# EAGLE design driver2REV1 (EAGLE 6.1)

## Sheet 1 of 2
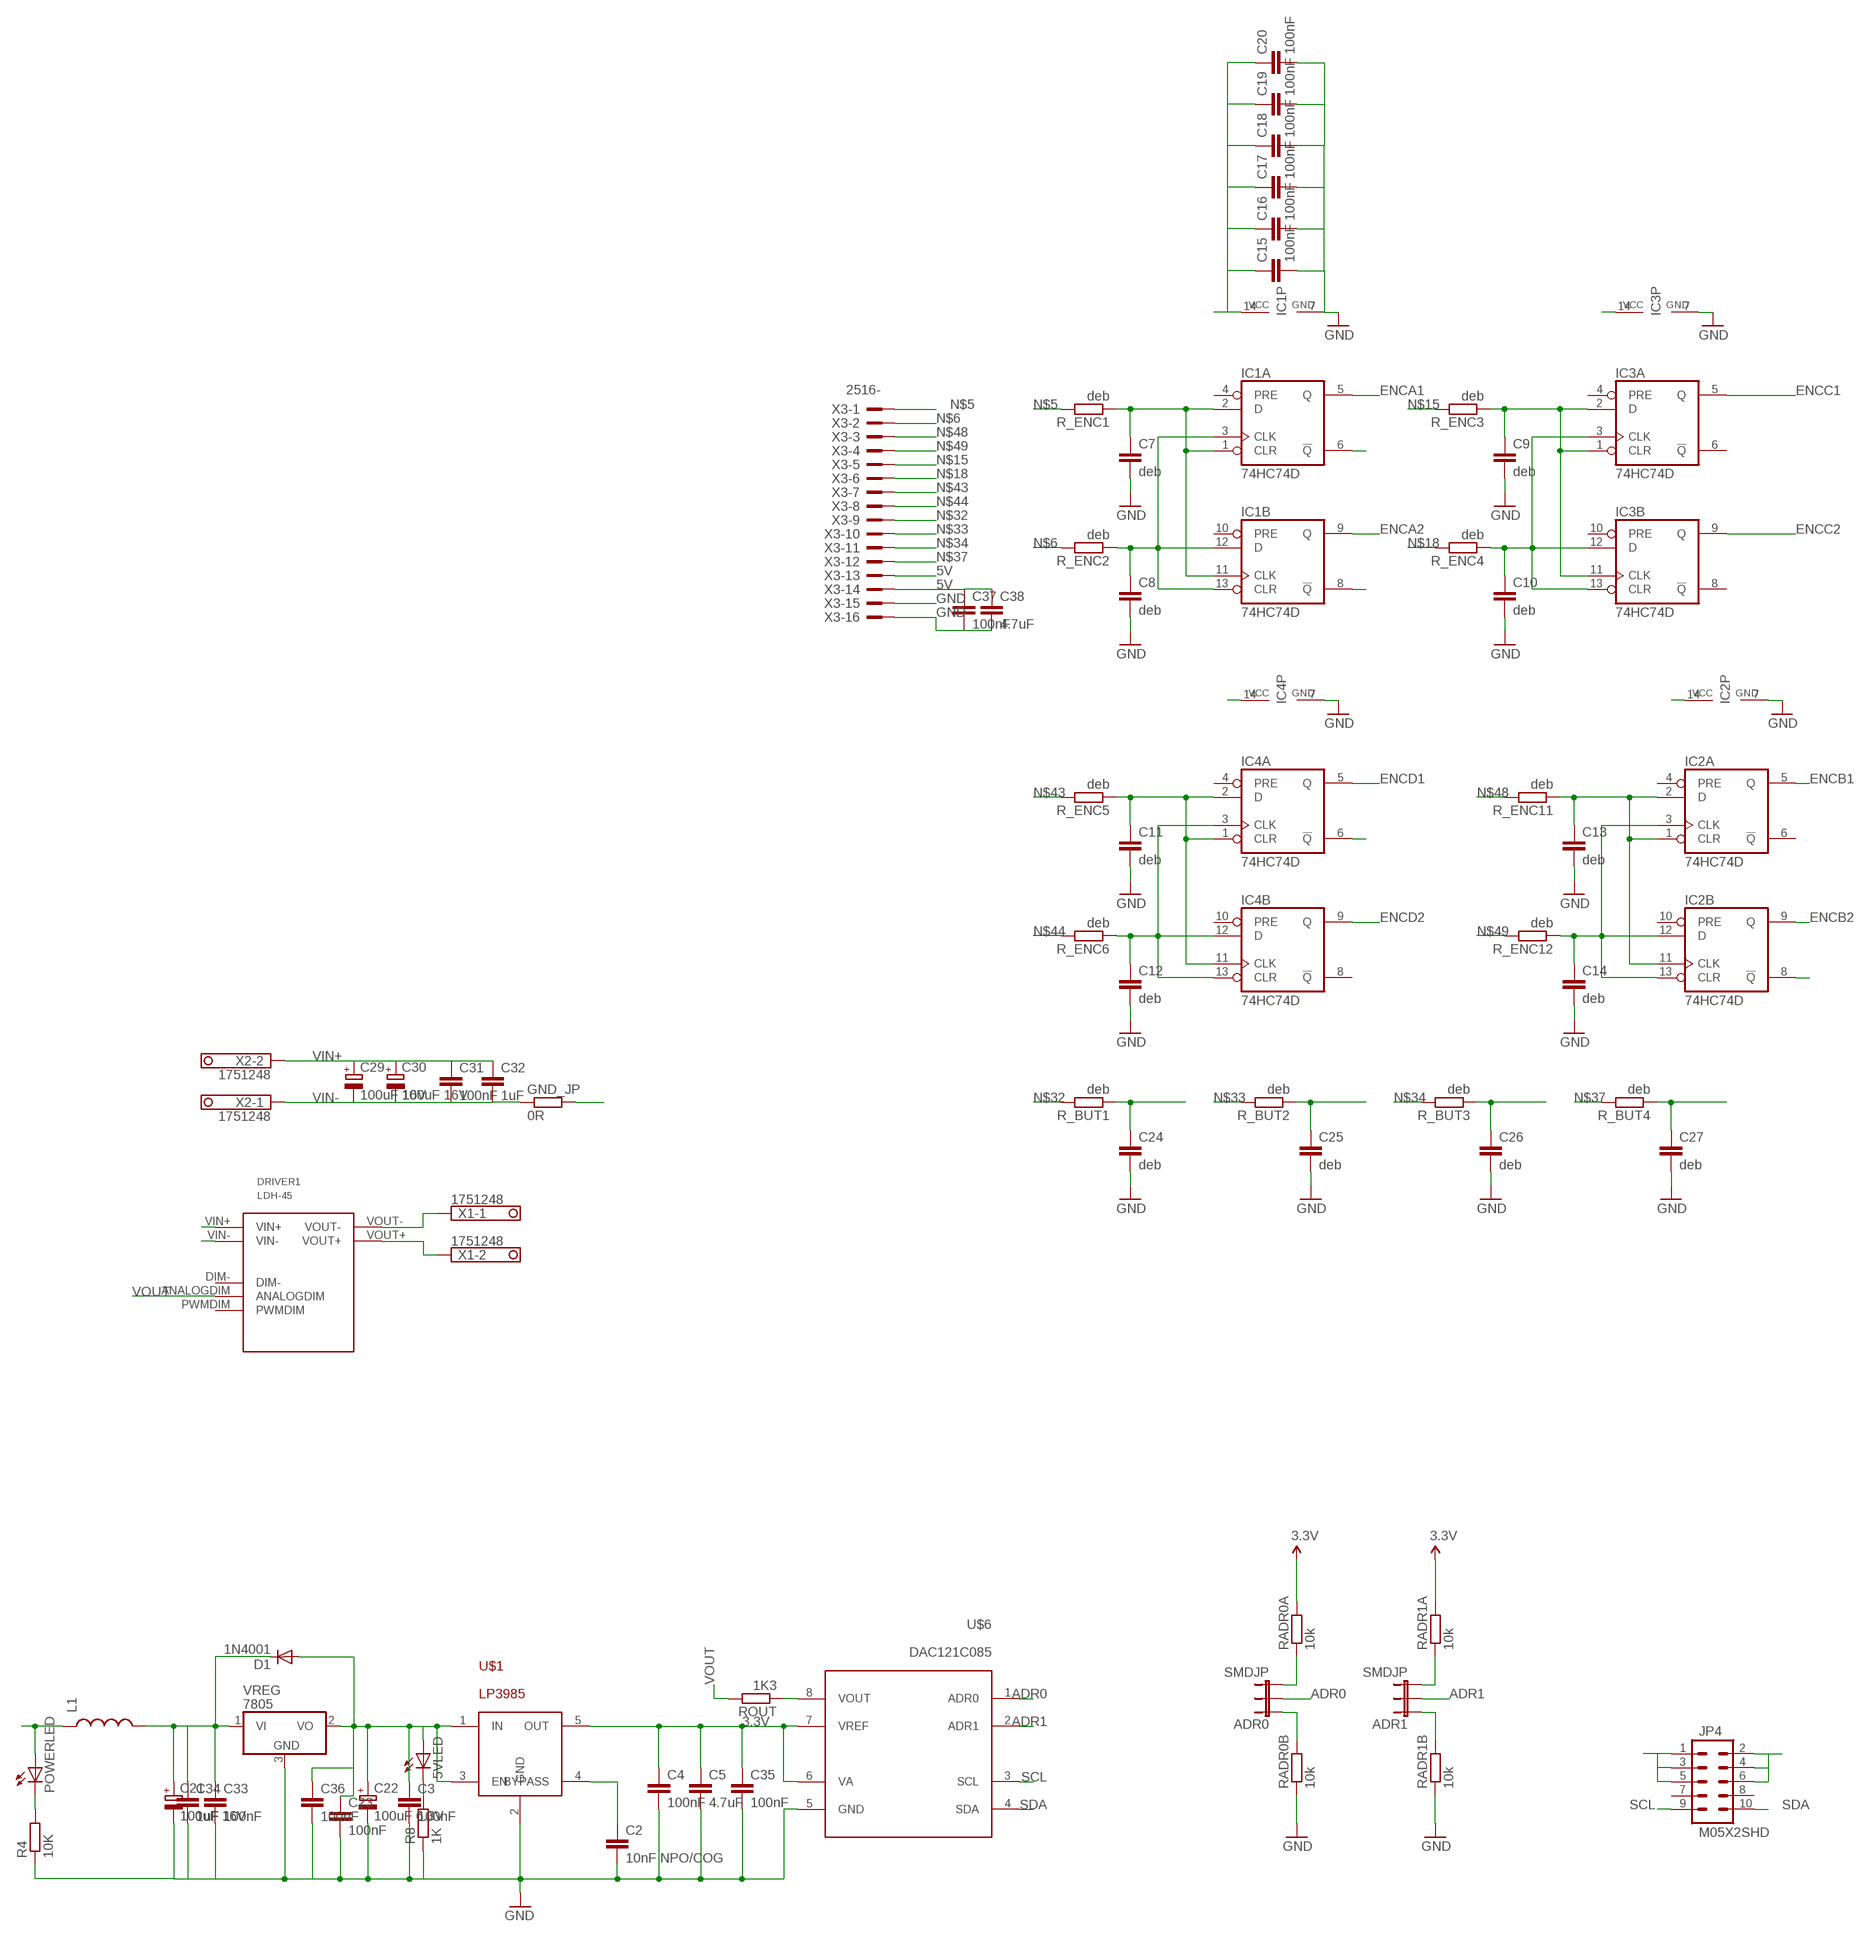
[diagram p0: schematic, sheet 1]

### Parts
5VLED  LEDCHIP-LED0805  [CHIP-LED0805]
ADR0  SMDJP  JUMPER-3-OLDSMD  [SJ_3]
ADR1  SMDJP  JUMPER-3-OLDSMD  [SJ_3]
C2  10nF NPO/COG  C-EUC0805  [C0805]
C3  100nF  C-EUC0805  [C0805]
C4  100nF  C-EUC0805  [C0805]
C5  4.7uF  C-EUC0805  [C0805]
C7  deb  C-EUC0805  [C0805]
C8  deb  C-EUC0805  [C0805]
C9  deb  C-EUC0805  [C0805]
C10  deb  C-EUC0805  [C0805]
C11  deb  C-EUC0805  [C0805]
C12  deb  C-EUC0805  [C0805]
C13  deb  C-EUC0805  [C0805]
C14  deb  C-EUC0805  [C0805]
C15  100nF  C-EUC0805  [C0805]
C16  100nF  C-EUC0805  [C0805]
C17  100nF  C-EUC0805  [C0805]
C18  100nF  C-EUC0805  [C0805]
C19  100nF  C-EUC0805  [C0805]
C20  100nF  C-EUC0805  [C0805]
C21  100uF 16V  CPOL-EUUD-6,3X8,8  [UD-6,3X5,8_NICHICON]
C22  100uF 6.3V  CPOL-EUUD-6,3X8,8  [UD-6,3X5,8_NICHICON]
C23  100nF  C-EUC0805  [C0805]
C24  deb  C-EUC0805  [C0805]
C25  deb  C-EUC0805  [C0805]
C26  deb  C-EUC0805  [C0805]
C27  deb  C-EUC0805  [C0805]
C29  100uF 16V  CPOL-EUUD-6,3X8,8  [UD-6,3X5,8_NICHICON]
C30  100uF 16V  CPOL-EUUD-6,3X8,8  [UD-6,3X5,8_NICHICON]
C31  100nF  C-EUC0805  [C0805]
C32  1uF  C-EUC0805  [C0805]
C33  100nF  C-EUC0805  [C0805]
C34  1uF  C-EUC0805  [C0805]
C35  100nF  C-EUC0805  [C0805]
C36  100nF  C-EUC0805  [C0805]
C37  100nF  C-EUC0805  [C0805]
C38  4.7uF  C-EUC0805  [C0805]
D1  1N4001  DIODESMB  [SMB-DIODE]
DRIVER1  LDH-45  [LDH-45]
GND_JP  0R  R-EU_R1210  [R1210]
IC1  74HC74D  [SO14]
IC2  74HC74D  [SO14]
IC3  74HC74D  [SO14]
IC4  74HC74D  [SO14]
JP4  M05X2SHD  [2X5-SHROUDED]
L1  INDUCTOR0805  [0805]
POWERLED  LEDCHIP-LED0805  [CHIP-LED0805]
R4  10K  R-EU_R0805  [R0805]
R8  1K  R-EU_R0805  [R0805]
R_BUT1  deb  R-EU_R0603  [R0603]
R_BUT2  deb  R-EU_R0603  [R0603]
R_BUT3  deb  R-EU_R0603  [R0603]
R_BUT4  deb  R-EU_R0603  [R0603]
R_ENC1  deb  R-EU_R0603  [R0603]
R_ENC2  deb  R-EU_R0603  [R0603]
R_ENC3  deb  R-EU_R0603  [R0603]
R_ENC4  deb  R-EU_R0603  [R0603]
R_ENC5  deb  R-EU_R0603  [R0603]
R_ENC6  deb  R-EU_R0603  [R0603]
R_ENC11  deb  R-EU_R0603  [R0603]
R_ENC12  deb  R-EU_R0603  [R0603]
RADR0A  10k  R-EU_R0603  [R0603]
RADR0B  10k  R-EU_R0603  [R0603]
RADR1A  10k  R-EU_R0603  [R0603]
RADR1B  10k  R-EU_R0603  [R0603]
ROUT  1K3  R-EU_R0603  [R0603]
U$1  LP3985  [SOT23-5]
U$6  DAC121C085  [VSSOP-8]
VREG  7805  7805DT  [TO252]
X1  1751248  [1751248]
X2  1751248  [1751248]
X3  2516-  [PAK100/2500-16]

### Nets
3.3V: C4.1 C5.1 C35.1 RADR0A.2 RADR1A.2 U$1.5(OUT) U$6.6(VA) U$6.7(VREF) ; also sheet 2
5V: 5VLED.A C3.1 C15.1 C16.1 C17.1 C18.1 C19.1 C20.1 C22.+ C23.1 C36.1 C37.1 C38.1 D1.A IC1.14(P:VCC) IC2.14(P:VCC) IC3.14(P:VCC) IC4.14(P:VCC) JP4.2 JP4.4 JP4.6 U$1.1(IN) U$1.3(EN) VREG.2(VO) X3.13 X3.14 ; also sheet 2
ADR0: ADR0.2 U$6.1(ADR0)
ADR1: ADR1.2 U$6.2(ADR1)
BUTA: C24.1 R_BUT1.1 ; also sheet 2
BUTB: C25.1 R_BUT2.1 ; also sheet 2
BUTC: C26.1 R_BUT3.1 ; also sheet 2
BUTD: C27.1 R_BUT4.1 ; also sheet 2
ENCA1: IC1.5(A:Q) ; also sheet 2
ENCA2: IC1.9(B:Q) ; also sheet 2
ENCB1: IC2.5(A:Q) ; also sheet 2
ENCB2: IC2.9(B:Q) ; also sheet 2
ENCC1: IC3.5(A:Q) ; also sheet 2
ENCC2: IC3.9(B:Q) ; also sheet 2
ENCD1: IC4.5(A:Q) ; also sheet 2
ENCD2: IC4.9(B:Q) ; also sheet 2
GND: C2.2 C3.2 C4.2 C5.2 C7.2 C8.2 C9.2 C10.2 C11.2 C12.2 C13.2 C14.2 C15.2 C16.2 C17.2 C18.2 C19.2 C20.2 C21.- C22.- C23.2 C24.2 C25.2 C26.2 C27.2 C33.2 C34.2 C35.2 C36.2 C37.2 C38.2 GND_JP.2 IC1.7(P:GND) IC2.7(P:GND) IC3.7(P:GND) IC4.7(P:GND) JP4.1 JP4.3 JP4.5 R4.1 R8.1 RADR0B.1 RADR1B.1 U$1.2(GND) U$6.5(GND) VREG.3(GND) X3.15 X3.16 ; also sheet 2
N$2: DRIVER1.VOUT+ X1.2
N$3: IC1.6(A:!Q)
N$4: IC1.8(B:!Q)
N$5: R_ENC1.2 X3.1
N$6: R_ENC2.2 X3.2
N$7: ADR0.3 RADR0A.1
N$9: ADR0.1 RADR0B.2
N$10: ADR1.3 RADR1A.1
N$11: ADR1.1 RADR1B.2
N$12: C2.1 U$1.4(BYPASS)
N$13: C7.1 IC1.1(A:CLR) IC1.2(A:D) IC1.11(B:CLK) R_ENC1.1
N$14: C8.1 IC1.3(A:CLK) IC1.12(B:D) IC1.13(B:CLR) R_ENC2.1
N$15: R_ENC3.2 X3.5
N$17: C21.+ C33.1 C34.1 D1.C L1.2 VREG.1(VI)
N$18: R_ENC4.2 X3.6
N$19: 5VLED.C R8.2
N$21: C9.1 IC3.1(A:CLR) IC3.2(A:D) IC3.11(B:CLK) R_ENC3.1
N$22: C10.1 IC3.3(A:CLK) IC3.12(B:D) IC3.13(B:CLR) R_ENC4.1
N$23: IC4.6(A:!Q)
N$27: C11.1 IC4.1(A:CLR) IC4.2(A:D) IC4.11(B:CLK) R_ENC5.1
N$28: C12.1 IC4.3(A:CLK) IC4.12(B:D) IC4.13(B:CLR) R_ENC6.1
N$29: POWERLED.C R4.2
N$32: R_BUT1.2 X3.9
N$33: R_BUT2.2 X3.10
N$34: R_BUT3.2 X3.11
N$37: R_BUT4.2 X3.12
N$42: IC2.8(B:!Q)
N$43: R_ENC5.2 X3.7
N$44: R_ENC6.2 X3.8
N$45: C13.1 IC2.1(A:CLR) IC2.2(A:D) IC2.11(B:CLK) R_ENC11.1
N$46: C14.1 IC2.3(A:CLK) IC2.12(B:D) IC2.13(B:CLR) R_ENC12.1
N$47: ROUT.1 U$6.8(VOUT)
N$48: R_ENC11.2 X3.3
N$49: R_ENC12.2 X3.4
SCL: JP4.9 U$6.3(SCL) ; also sheet 2
SDA: JP4.10 U$6.4(SDA) ; also sheet 2
VIN+: C29.+ C30.+ C31.1 C32.1 DRIVER1.VIN+ L1.1 POWERLED.A X2.2
VIN-: C29.- C30.- C31.2 C32.2 DRIVER1.VIN- GND_JP.1 X2.1
VOUT: DRIVER1.ANALOGDIM ROUT.2
VOUT-: DRIVER1.VOUT- X1.1
Unconnected: DRIVER1.DIM- DRIVER1.PWMDIM IC1.4(A:PRE) IC1.10(B:PRE) IC2.4(A:PRE) IC2.6(A:!Q) IC2.10(B:PRE) IC3.4(A:PRE) IC3.6(A:!Q) IC3.8(B:!Q) IC3.10(B:PRE) IC4.4(A:PRE) IC4.8(B:!Q) IC4.10(B:PRE) JP4.7 JP4.8

## Sheet 2 of 2
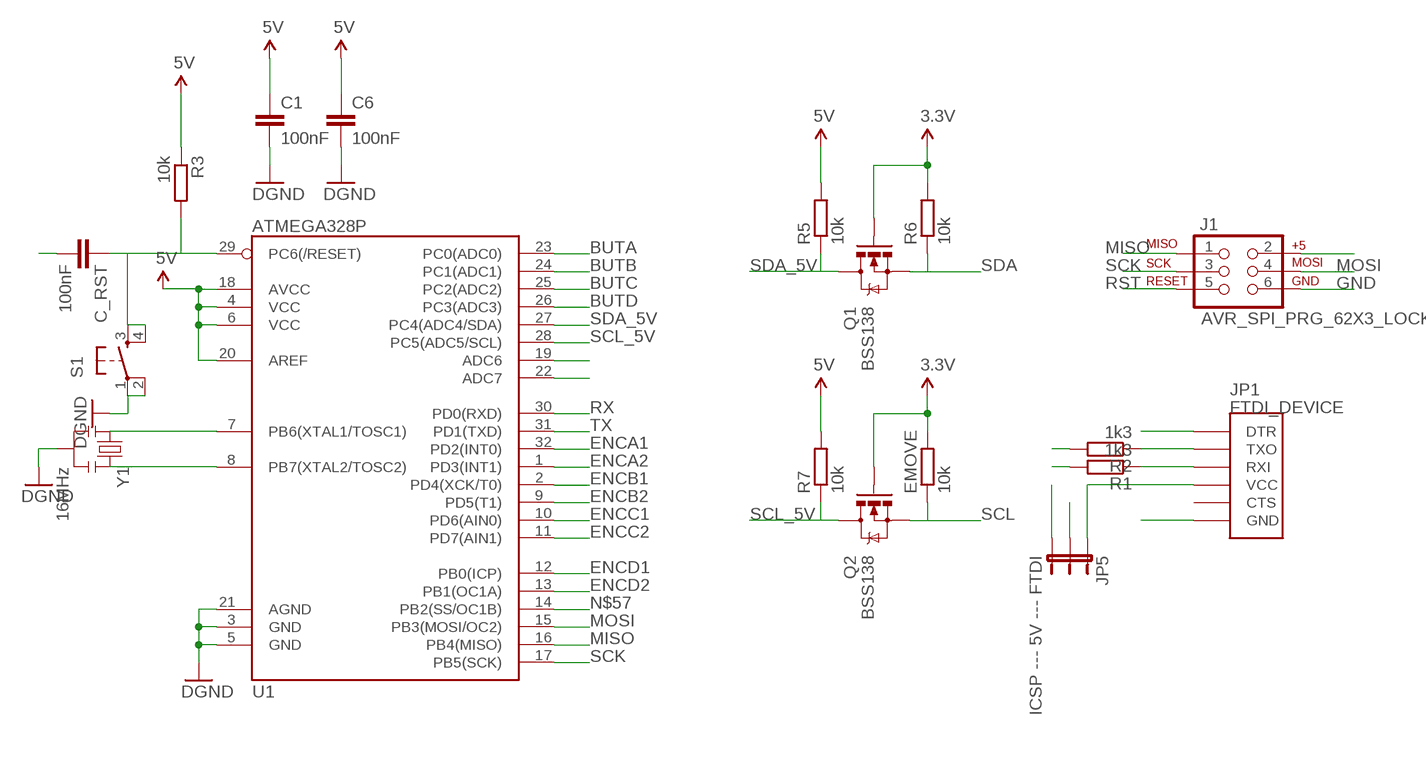
[diagram p1: schematic, sheet 2]

### Parts
C1  100nF  C-EUC0805  [C0805]
C6  100nF  C-EUC0805  [C0805]
C_RST  100nF  C-EUC0805  [C0805]
EMOVE  10k  R-EU_R0603  [R0603]
J1  AVR_SPI_PRG_62X3_LOCK  [2X3_LOCK]
JP1  FTDI_DEVICE  [FTDI_DEVICE_SIDE]
JP5  ICSP --- 5V --- FTDI  JUMPER-3SMD  [SJ_3]
Q1  BSS138  MOSFET-NCHANNELBSS138  [SOT23]
Q2  BSS138  MOSFET-NCHANNELBSS138  [SOT23]
R1  1k3  R-EU_R0603  [R0603]
R2  1k3  R-EU_R0603  [R0603]
R3  10k  R-EU_R0603  [R0603]
R5  10k  R-EU_R0603  [R0603]
R6  10k  R-EU_R0603  [R0603]
R7  10k  R-EU_R0603  [R0603]
S1  TAC_SWITCHSMD  [TACTILE_SWITCH_SMD]
U1  ATMEGA328P  ATMEGA328_SMT  [TQFP32-08]
Y1  16MHz  RESONATOR8MHZ  [RESONATOR-SMD]

### Nets
3.3V: EMOVE.2 Q1.1(G) Q2.1(G) R6.2 ; also sheet 1
5V: C1.1 C6.1 JP5.2 R3.1 R5.2 R7.2 U1.4(VCC) U1.6(VCC) U1.18(AVCC) U1.20(AREF) ; also sheet 1
BUTA: U1.23(PC0(ADC0)) ; also sheet 1
BUTB: U1.24(PC1(ADC1)) ; also sheet 1
BUTC: U1.25(PC2(ADC2)) ; also sheet 1
BUTD: U1.26(PC3(ADC3)) ; also sheet 1
ENCA1: U1.32(PD2(INT0)) ; also sheet 1
ENCA2: U1.1(PD3(INT1)) ; also sheet 1
ENCB1: U1.2(PD4(XCK/T0)) ; also sheet 1
ENCB2: U1.9(PD5(T1)) ; also sheet 1
ENCC1: U1.10(PD6(AIN0)) ; also sheet 1
ENCC2: U1.11(PD7(AIN1)) ; also sheet 1
ENCD1: U1.12(PB0(ICP)) ; also sheet 1
ENCD2: U1.13(PB1(OC1A)) ; also sheet 1
FTDI_RST: C_RST.2 JP1.P$1(DTR)
GND: C1.2 C6.2 J1.6 JP1.P$6(GND) S1.1 S1.2 U1.3(GND) U1.5(GND) U1.21(AGND) Y1.2 ; supply symbol labelled DGND ; also sheet 1
ISP_5V: J1.2 JP5.3
MISO: J1.1 U1.16(PB4(MISO))
MOSI: J1.4 U1.15(PB3(MOSI/OC2))
N$8: U1.7(PB6(XTAL1/TOSC1)) Y1.1
N$16: U1.8(PB7(XTAL2/TOSC2)) Y1.3
N$20: JP1.P$2(TXO) R2.1
N$24: JP1.P$3(RXI) R1.1
N$25: JP1.P$4(VCC) JP5.1
N$35: U1.19(ADC6)
N$36: U1.22(ADC7)
N$57: U1.14(PB2(SS/OC1B))
RST: C_RST.1 J1.5 R3.2 S1.3 S1.4 U1.29(PC6(/RESET))
RX: R1.2 U1.30(PD0(RXD))
SCK: J1.3 U1.17(PB5(SCK))
SCL: EMOVE.1 Q2.2(S) ; also sheet 1
SCL_5V: Q2.3(D) R7.1 U1.28(PC5(ADC5/SCL))
SDA: Q1.2(S) R6.1 ; also sheet 1
SDA_5V: Q1.3(D) R5.1 U1.27(PC4(ADC4/SDA))
TX: R2.2 U1.31(PD1(TXD))
Unconnected: JP1.P$5(CTS)

## Library data of the parts
5VLED POWERLED = adafruit:LED: LED OSRAM: - CHIPLED LG R971, LG N971, LY N971, LG Q971, LY Q971, LO R971, LY R971 LH N974, LH R974 LS Q976, LO Q976, LY Q976 LO Q996 - Hyper CHIPLED LW Q18S LB Q993, LB Q99A, LB R99A - SideLED LS A670, LO A670, LY A670, LG A670, LP A670 LB A673, LV A673, LT A673, LW A673 LH A674 LY A675 LS A676, LA A676, LO A676, LY A676, LW A676 LS A679, LY A679, LG A679 - Hyper Micro SIDELED® LS Y876, LA Y876, LO Y876, LY Y876 LT Y87S - SmartLED LW L88C, LW L88S LB L89C, LB L89S, LG L890 LS L89K, LO L89K, LY L89K LS L896, LA L896, LO L896, LY L896 - TOPLED LS T670, LO T670, LY T670, LG T670, LP T670 LSG T670, LSP T670, LSY T670, LOP T670, LYG T670 LG T671, LOG T671, LSG T671 LB T673, LV T673, LT T673, LW T673 LH T674 LS T676, LA T676, LO T676, LY T676, LB T676, LH T676, LSB T676, LW T676 LB T67C, LV T67C, LT T67C, LS T67K, LO T67K, LY T67K, LW E67C LS E67B, LA E67B, LO E67B, LY E67B, LB E67C, LV E67C, LT E67C LW T67C LS T679, LY T679, LG T679 LS T770, LO T770, LY T770, LG T770, LP T770 LB T773, LV T773, LT T773, LW T773 LH T774 LS E675, LA E675, LY E675, LS T675 LS T776, LA T776, LO T776, LY T776, LB T776 LHGB T686 LT T68C, LB T68C - Hyper Mini TOPLED® LB M676 - Mini TOPLED Santana® LG M470 LS M47K, LO M47K, LY M47K Source: http://www.osram.convergy.de/
ADR0 ADR1 = SparkFun-Passives:JUMPER-3-OLD
C1-C20 C23-C27 C31-C38 C_RST = wes:C-EU: CAPACITOR, European symbol
C21 C22 C29 C30 = rcl:CPOL-EU: POLARIZED CAPACITOR, European symbol
D1 = SparkFun-DiscreteSemi:DIODE: Diode These are standard reverse protection diodes and small signal diodes. SMA package can handle up to about 1A. SOD-323 can handle about 200mA. What the SOD-323 package when ordering, there are some mfgs out there that are 5-pin packages.
DRIVER1 = wes:LDH-45
EMOVE R1-R8 R_BUT1-R_BUT4 R_ENC1-R_ENC6 R_ENC11 R_ENC12 RADR0A RADR0B RADR1A RADR1B ROUT = wes:R-EU_: RESISTOR, European symbol
GND_JP = rcl:R-EU_: RESISTOR, European symbol
IC1-IC4 = 74xx-eu:74*74: Dual D type positive edge triggered FLIP FLOP, preset and clear
J1 = SparkFun-Connectors:AVR_SPI_PRG_6: AVR ISP 6 Pin This is the reduced ISP connector for AVR programming. Common on Arduino. This footprint will take up less PCB space and can be used with a 10-pin to 6-pin adapter such as SKU: BOB-08508
JP1 = SparkFun-Connectors:FTDI_DEVICE: Connector which mates to FTDI basic or FTDI cable.
JP4 = SparkFun-Connectors:M05X2: Header 5x2 Standard 10-pin dual row 0.1" header. Commonly used with AVR-ISP. Use with Spark Fun Electronics SKU: PRT-00778
JP5 = SparkFun-Passives:JUMPER-3
L1 = SparkFun-Passives:INDUCTOR: Inductors Basic Inductor/Choke - 0603 and 1206. Footprints are not proven and vary greatly between part numbers.
Q1 Q2 = SparkFun-DiscreteSemi:MOSFET-NCHANNEL: Common NMOSFET Parts MFG P/N Store ID Prod ID FDD8780 TRANS-09984 SI7820DN TRANS-11055 FDS6630A IC-08089 2N7002PW TRANS-11151 FQP30N06L COM-10213 TRANS-10060 BSS123LT1G TRANS-08345 BSS138 TRANS-00830 BS170 2N7000; PROD_ID: TRANS-00830
S1 = SparkFun-Electromechanical:TAC_SWITCH: Momentary Switch Button commonly used for reset or general input. Spark Fun Electronics SKU : COM-00097 SMT- SWCH-08247; PROD_ID: SWCH-08247
U1 = SparkFun-DigitalIC:ATMEGA328_SMT: 32-Pin Atmega328 part Commonly used on Arduino compatible boards Available in QFP and QFN packages TQFP is IC-09069 QFN is non-stock; PROD_ID: IC-09069
U$1 = wes:LP3985
U$6 = wes:DAC121C085
VREG = adafruit:78*: Positive VOLTAGE REGULATOR Added bigger pads to the TO-92 package
X1 X2 = con-phoenix-350:1751248: MKDS 1/ 2-3,5 Printklemme Nennstrom: 10 A Bemessungsspannung: 160 V Raster: 3,5 mm Polzahl: 2 Montageart: Löten Anschlussart: Schraubanschluss Anschlussrichtung vom Leiter zur Platine: 0° Source: http://eshop.phoenixcontact.com .. 1751248.pdf; OC_FARNELL: unknown; OC_NEWARK: unknown
X3 = con-3m:2516-: 3M (TM) Pak 100 4-Wall Header Source: 3M; OC_FARNELL: unknown; OC_NEWARK: unknown
Y1 = SparkFun-FreqCtrl:RESONATOR: Resonator Small SMD resonator. Used, eg, on the Arduino Pro/ Pro Mini boards. 8MHz- XTAL-08895 16MHz- XTAL-08900; PROD_ID: XTAL-08895; VALUE: 8MHZ

## Board
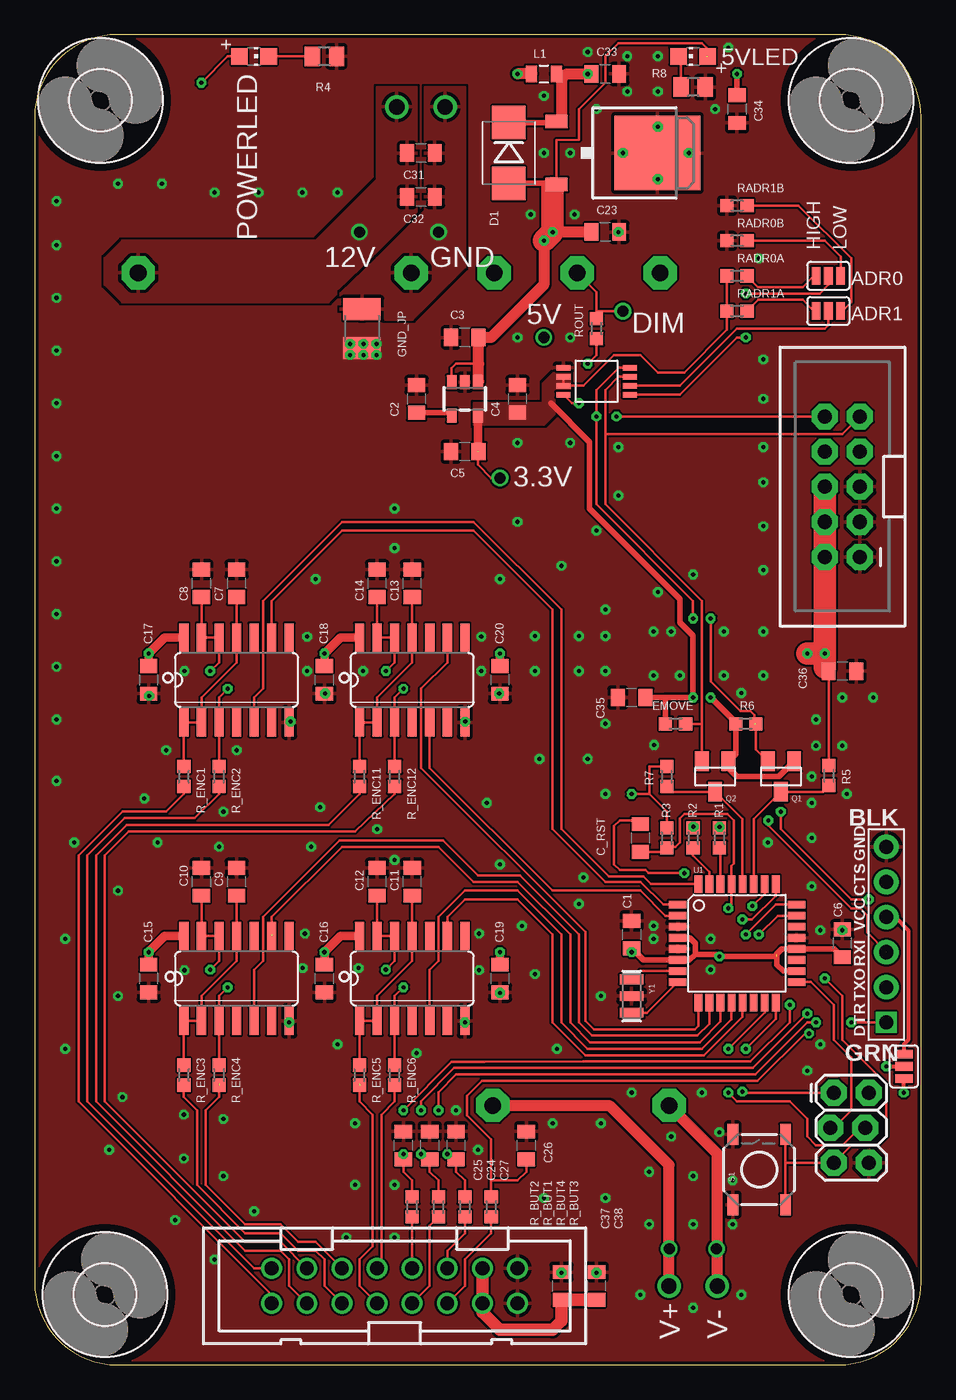
[diagram p2: board, top side]
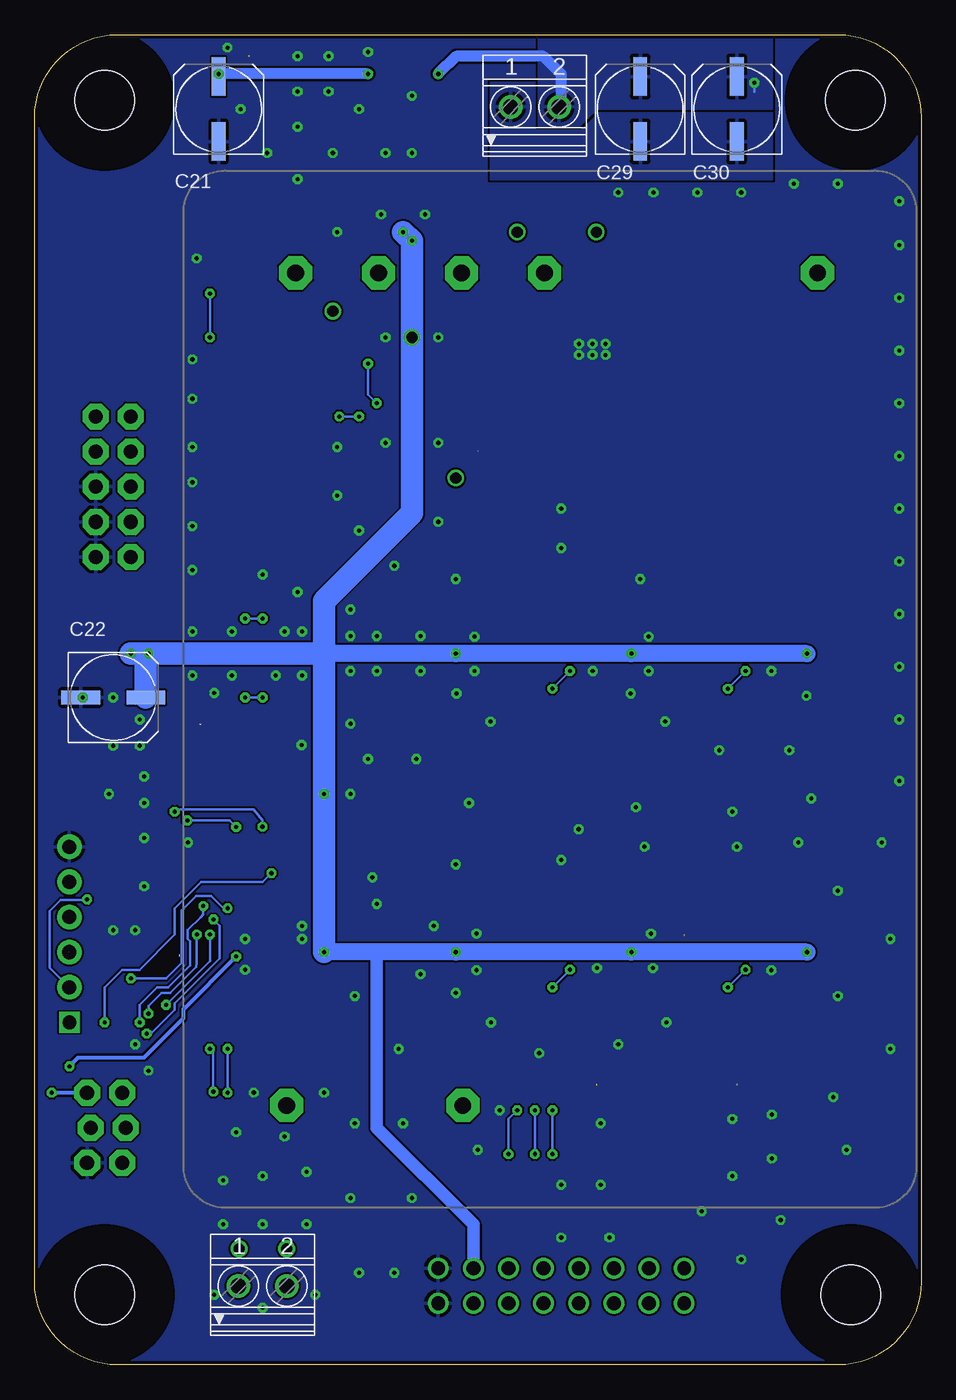
[diagram p3: board, bottom side, seen from below]

Size 64.11 x 96.19 mm. Coordinates in mm from the lower left corner, seen from the top.
Outline: 0,90.19 0,6 arc90 6,0 58.12,0 arc90 64.11,6 64.11,90.19 arc90 58.12,96.19 6,96.19 arc90 0,90.19
Copper layers (1*16): Top 0.035mm / dielectric 1.5mm / Bottom 0.035mm
Design rules: minimum track width 6mil, minimum drill 0.29mm, track to track 6mil, track to pad 7mil, pad to pad 7mil, via to via 7mil, smd to smd 7mil, copper to edge 10mil, drill to drill 8mil, minimum pad ring 10mil, minimum via ring 8mil, stop-mask expansion 0.4mm, vias tented up to drill 0.3mm, thermal gap 10mil

### Footprints (pad centres in the part's own frame; a part is rotated, then mirrored left to right if it is on the bottom)
CHIP-LED0805 = smd 1.2 x 1.2: A 0,-1.05; C 0,1.05
SJ_3 = smd 0.635 x 1.27: 1 -0.889,0; 2 0,0; 3 0.889,0
C0805 = smd 1 x 1.25: 1 -1,0; 2 1,0
UD-6,3X5,8_NICHICON = smd 2.8 x 1: + 2.35,0; - -2.35,0
SMB-DIODE = smd 2.4 x 2.4: A 2.2,0; C -2.2,0
LDH-45 = drill 1.2 pad 2.4 octagon: ANALOGDIM 14.1,-7.4; DIM- 20.1,-7.4; PWMDIM 8.1,-7.4; VIN+ 45.85,-7.4; VIN- 26.1,-7.4; VOUT+ 20.2,-67.6; VOUT- 7.45,-67.6
R0603 = smd 0.95 x 0.95: 1 -0.725,0; 2 0.725,0
R1210 = smd 1.6 x 2.7: 1 -1.4,0; 2 1.4,0
SO14 = smd 0.66 x 2.032: 1 -3.81,-3.073; 2 -2.54,-3.073; 3 -1.27,-3.073; 4 0,-3.073; 5 1.27,-3.073; 6 2.54,-3.073; 7 3.81,-3.073; 8 3.81,3.073; 9 2.54,3.073; 10 1.27,3.073; 11 0,3.073; 12 -1.27,3.073; 13 -2.54,3.073; 14 -3.81,3.073
2X3_LOCK = drill 1.016 pad 1.88 octagon: 1 0,0; 2 0,2.54; 3 2.54,-0.254; 4 2.54,2.286; 5 5.08,0; 6 5.08,2.54
FTDI_DEVICE_SIDE = drill 1 square: P$1 -6.35,0 | drill 1.016 pad 1.778: P$2 -3.81,0; P$3 -1.27,0; P$4 1.27,0; P$5 3.81,0; P$6 6.35,0
2X5-SHROUDED = drill 1.016 pad 1.88 octagon: 1 -1.27,5.08; 2 1.27,5.08; 3 -1.27,2.54; 4 1.27,2.54; 5 -1.27,0; 6 1.27,0; 7 -1.27,-2.54; 8 1.27,-2.54; 9 -1.27,-5.08; 10 1.27,-5.08
0805 = smd 0.8 x 1.2: 1 -0.9,0; 2 0.9,0
SOT23 = smd 1 x 1.4: 1 -0.95,-1.1; 2 0.95,-1.1; 3 0,1.1
R0805 = smd 1.1 x 1.4: 1 -0.875,0; 2 0.875,0
TACTILE_SWITCH_SMD = smd 1.524 x 0.762: 1 -2.54,1.905; 2 2.54,1.905; 3 -2.54,-1.905; 4 2.54,-1.905
TQFP32-08 = smd 1.27 x 0.559: 1 -4.293,2.8; 2 -4.293,2; 3 -4.293,1.2; 4 -4.293,0.4; 5 -4.293,-0.4; 6 -4.293,-1.2; 7 -4.293,-2; 8 -4.293,-2.8; 17 4.293,-2.8; 18 4.293,-2; 19 4.293,-1.2; 20 4.293,-0.4; 21 4.293,0.4; 22 4.293,1.2; 23 4.293,2; 24 4.293,2.8 | smd 0.559 x 1.27: 9 -2.8,-4.293; 10 -2,-4.293; 11 -1.2,-4.293; 12 -0.4,-4.293; 13 0.4,-4.293; 14 1.2,-4.293; 15 2,-4.293; 16 2.8,-4.293; 25 2.8,4.293; 26 2,4.293; 27 1.2,4.293; 28 0.4,4.293; 29 -0.4,4.293; 30 -1.2,4.293; 31 -2,4.293; 32 -2.8,4.293
SOT23-5 = smd 0.7 x 1: 1 0.95,1.2; 2 0,1.2; 3 -0.95,1.2; 4 -0.95,-1.2; 5 0.95,-1.2
4,3 = hole 4.3: 0,0
VSSOP-8 = smd 0.406 x 1.016: 1 -0.975,-2.4; 2 -0.325,-2.4; 3 0.325,-2.4; 4 0.975,-2.4; 5 0.975,2.4; 6 0.325,2.4; 7 -0.325,2.4; 8 -0.975,2.4
TO252 = smd 1 x 1.6: 1 -2.28,-4.8; 2 2.28,-4.8 | smd 5.4 x 6.2: 3 0,2.5
1751248 = drill 1.1 pad 1.7: 1 -1.75,-0.1; 2 1.75,-0.1
PAK100/2500-16 = drill 1 pad 1.422: 1 -8.89,-1.27; 2 -8.89,1.27; 3 -6.35,-1.27; 4 -6.35,1.27; 5 -3.81,-1.27; 6 -3.81,1.27; 7 -1.27,-1.27; 8 -1.27,1.27; 9 1.27,-1.27; 10 1.27,1.27; 11 3.81,-1.27; 12 3.81,1.27; 13 6.35,-1.27; 14 6.35,1.27; 15 8.89,-1.27; 16 8.89,1.27
RESONATOR-SMD = smd 0.7 x 1.7: 1 -1.2,0; 2 0,0; 3 1.2,0

### Placement (x,y rotation side)
5VLED  47.62,94.61 90 top
ADR0  57.4,78.74 180 top
ADR1  57.4,76.2 180 top
C1  43.18,31.11 90 top
C2  27.62,69.85 90 top
C3  31.11,74.3 180 top
C4  34.92,69.85 90 top
C5  31.11,66.04 180 top
C6  58.42,30.48 90 top
C7  14.61,56.52 90 top
C8  12.06,56.52 90 top
C9  14.61,34.92 90 top
C10  12.06,34.92 90 top
C11  27.3,34.92 90 top
C12  24.77,34.92 90 top
C13  27.3,56.52 90 top
C14  24.77,56.52 90 top
C15  8.26,27.95 270 top
C16  20.95,27.94 270 top
C17  8.26,49.53 270 top
C18  20.95,49.53 270 top
C19  33.66,27.94 270 top
C20  33.66,49.53 270 top
C21  50.8,90.81 90 bottom
C22  58.42,48.26 0 bottom
C23  41.27,81.92 0 top
C24  28.57,15.88 90 top
C25  26.67,15.88 90 top
C26  35.56,15.88 90 top
C27  30.48,15.88 90 top
C29  20.32,90.81 90 bottom
C30  13.34,90.81 90 bottom
C31  27.94,87.63 0 top
C32  27.94,84.45 0 top
C33  41.27,93.34 0 top
C34  50.8,90.81 270 top
C35  43.18,48.26 180 top
C36  58.42,50.16 0 top
C37  38.1,5.71 90 top
C38  40.64,5.71 90 top
C_RST  43.81,38.1 90 top
D1  34.29,87.63 270 top
DRIVER1  53.34,86.36 0 bottom
EMOVE  46.35,46.35 180 top
GND_JP  23.68,74.93 270 top
IC1  14.61,49.53 0 top
IC2  27.3,49.53 0 top
IC3  14.61,27.94 0 top
IC4  27.3,27.94 0 top
J1  57.78,19.68 270 top
JP1  61.59,31.11 90 top
JP4  58.42,63.5 180 top
JP5  62.87,21.59 270 top
L1  36.83,93.34 0 top
POWERLED  15.88,94.61 270 top
Q1  53.98,42.55 180 top
Q2  49.22,42.55 180 top
R1  49.53,38.1 270 top
R2  47.62,38.1 270 top
R3  45.72,38.1 270 top
R4  20.95,94.61 180 top
R5  57.44,42.62 90 top
R6  51.44,46.35 180 top
R7  45.72,42.55 90 top
R8  47.62,92.39 180 top
R_BUT1  29.21,11.43 270 top
R_BUT2  27.3,11.43 270 top
R_BUT3  33.02,11.43 270 top
R_BUT4  31.11,11.43 270 top
R_ENC1  10.79,42.55 270 top
R_ENC2  13.34,42.55 270 top
R_ENC3  10.79,20.95 270 top
R_ENC4  13.34,20.95 270 top
R_ENC5  23.5,20.95 270 top
R_ENC6  26.04,20.95 270 top
R_ENC11  23.5,42.55 270 top
R_ENC12  26.04,42.55 270 top
RADR0A  50.8,78.74 180 top
RADR0B  50.8,81.28 0 top
RADR1A  50.8,76.2 180 top
RADR1B  50.8,83.82 0 top
ROUT  40.64,74.93 90 top
S1  52.4,14.12 90 top
U1  50.8,30.48 0 top
U$1  31.11,69.85 0 top
U$2  [4,3]  4.76,91.44 0 top
U$3  [4,3]  59.05,91.44 0 top
U$4  [4,3]  5.08,5.08 0 top
U$5  [4,3]  59.05,5.08 0 top
U$6  40.64,71.12 90 top
VREG  42.55,87.63 270 top
X1  47.62,5.8 0 bottom
X2  27.94,91.06 0 bottom
X3  26.04,5.71 0 top
Y1  43.18,26.67 270 top

### Tracks (layer width: path | path; a pad name or v marks a point on that pad's centre or on a via)
3.3V  (via drill 0.3 pad 0.5, 0.8 pad 0.5)  (1 unrouted)
  Top 0.178: U$1.5 32.06,68.89 | 32.06,66.09 C5.1 | Q2.1 50.17,43.18 | R6.2 50.71,46.45 | RADR0A.2 RADR1A.2 50.08,74.84 46.99,71.75 45.09,71.75 43.81,73.03 41.91,73.03 39.68,70.8 U$6.7 U$6.6 | 32.07,66.04 32.07,65.09 33.02,64.14 v33.66,64.14
  Top 0.406: 50.17,43.18 50.8,42.55 53.83,42.55 Q1.1 | R6.2 50.71,44.19 Q2.1 | 50.71,46.45 v48.9,48.26 | 45.63,48.26 45.72,48.26 v47.62,48.26 47.62,52.72 46.67,53.67 46.67,55.38 40.14,61.92 40.14,66.74 37.34,69.54 | 45.63,48.26 EMOVE.2 | C35.1 45.63,48.26
  Top 0.61: U$1.5 32.06,66.09
  Bottom 0.178: v48.9,48.26 v47.62,48.26
  pour Top (no thermals): 38.74,71.72 37.49,71.72 36.72,70.94 36.72,69.54 31.72,69.54 31.72,67.99 36.87,67.99 37.65,68.76 37.65,70.48 38.74,70.48
5V  (via drill 0.3 pad 0.5, 0.8 pad 0.5)  (2 unrouted)
  Top 0.178: R3.1 45.72,40.01 44.45,41.27 | 44.45,41.27 44.45,43.27 R7.2 | 44.45,41.27 v43.18,41.27 | R5.2 57.44,50.15 C36.1 | VREG.2 37.74,88.55 39.37,88.58 39.37,90.81 41.27,92.71 41.27,94.61 42.23,95.57 48.26,95.57 48.58,95.25 48.58,94.61 | U$1.3 30.16,72.08 30.48,72.39 32.12,72.39
  Top 0.305: v61.59,21.59 JP5.2
  Top 0.406: U1.4 47.38,30.88 47.78,30.48 47.78,29.69 | 47.78,29.69 47.37,29.28 U1.6 44.02,29.28 43.45,29.84 v43.18,29.84 C1.1 | U1.18 54.13,28.48 53.67,28.94 53.67,29.71 | 53.67,29.71 54.04,30.08 U1.20 57.82,30.08 C6.1 | 53.65,29.69 53.67,29.71 | VREG.2 37.03,85.43 D1.A | U$1.1 32.12,71.1 | C36.1 57.15,50.44 | 47.78,29.69 49.37,29.69 v49.53,29.53 53.66,29.53
  Top 0.61: IC3.14 9.42,31.01 v8.26,29.84 C15.1 | C16.1 v20.95,29.84 22.12,31.01 IC4.14 23.5,31.75 | IC1.14 9.42,52.6 v8.26,51.44 C17.1 | IC2.14 22.12,52.6 v20.95,51.44 C18.1 | C19.1 v33.66,29.84 | C20.1 v33.66,51.44
  Top 0.813: VREG.2 37.47,85.07 | C23.1 v37.47,81.92 | v36.83,81.28 36.83,78.11 33.02,74.3 C3.1 32.12,72.39 32.12,71.1
  Top 0.914: X3.14 X3.13 32.38,3.81 33.66,2.54 37.47,2.54 38.1,3.17 C37.1 C38.1
  Top 1.626: 37.47,85.07 v37.47,81.92 v36.83,81.28 | 57.15,50.44 v57.15,51.44 | v57.15,51.44 JP4.2 JP4.4 JP4.6 | v55.88,51.44 v57.15,51.44
  Bottom 0.305: v49.53,29.53 53.34,25.72 53.34,25.08 56.2,22.23 60.96,22.23 v61.59,21.59
  Bottom 0.914: 39.37,29.84 39.37,17.14 32.38,10.16 X3.14
  Bottom 1.219: v8.26,29.84 v20.95,29.84 v33.66,29.84 39.37,29.84 v43.18,29.84 | v8.26,51.44 v20.95,51.44 v33.66,51.44 43.18,51.44
  Bottom 1.626: v43.18,29.84 v43.18,41.27 43.18,51.44 | 43.18,51.44 43.18,55.24 36.83,61.59 v36.83,74.3 v36.83,81.28 v37.47,81.92 | 43.18,51.44 v55.88,51.44 | v55.88,51.44 v57.15,51.44 | C22.+ 56.07,51.24 v55.88,51.44
ADR0  (via drill 0.3 pad 0.5)
  Top 0.178: ADR0.2 57.4,78.09 56.78,77.47 v51.44,77.47 | v51.44,74.3 50.8,74.3 46.65,70.14 U$6.1
  Bottom 0.178: v51.44,77.47 v51.44,74.3
ADR1
  Top 0.178: ADR1.2 57.4,75.18 57.15,74.93 50.8,74.93 46.66,70.8 U$6.2
BUTA  (via drill 0.3 pad 0.5)
  Top 0.178: R_BUT1.1 29.21,13.34 28.57,13.97 C24.1 28.3,14.88 v27.94,15.24 | v27.94,18.41 27.94,19.07 30.34,21.47 51.95,21.47 v55.88,25.4 | U1.23 53.75,32.48 v52.38,31.11
  Bottom 0.178: v27.94,15.24 v27.94,18.41 | v55.88,25.4 55.88,25.95 54.92,26.91 54.3,26.91 52.43,28.78 52.38,29.05 v52.38,31.11
BUTB  (via drill 0.3 pad 0.5)
  Top 0.178: R_BUT2.1 27.3,13.34 26.67,13.97 C25.1 v26.67,15.24 | v26.67,18.41 30.17,21.91 32.54,21.91 39.67,21.94 51.78,21.94 54.61,24.77 v54.61,26.04 | U1.24 53.6,33.28 v51.44,31.11
  Bottom 0.178: v26.67,15.24 v26.67,18.41 | v54.61,26.04 51.44,29.21 v51.44,31.11
BUTC  (via drill 0.3 pad 0.5)
  Top 0.178: 33.02,13.34 34.92,13.34 35.56,13.97 C26.1 | R_BUT3.1 33.02,13.34 | 33.02,13.34 33.02,16.3 31.27,18.05 31.27,19.45 32.36,20.54 52.29,20.54 55.72,23.97 55.99,23.97 v56.01,23.96 | U1.25 53.6,33.91 51.89,32.2 v51.18,32.2
  Bottom 0.178: v56.01,23.96 55.7,23.96 53.98,25.67 53.98,26.14 50.72,29.4 50.72,31.74 v51.18,32.2
BUTD  (via drill 0.3 pad 0.5)
  Top 0.178: R_BUT4.1 31.11,13.34 30.48,13.97 C27.1 30.21,14.88 v29.84,15.24 | v29.21,18.41 29.21,19.72 30.49,21 52.12,21 55.88,24.77 v56.52,24.77 | U1.26 52.8,34.06 v51.91,33.18
  Bottom 0.178: v29.84,15.24 29.84,17.78 v29.21,18.41 | v56.52,24.77 56.52,26.04 55.24,27.3 54.45,27.3 52.86,28.9 52.86,30.64 53.03,30.8 53.03,31.44 52.12,32.35 52.12,32.36 51.91,32.56 v51.91,33.18
ENCA1
  Top 0.178: U1.32 44.57,34.77 44.03,35.32 41.52,35.32 38.1,38.73 38.1,54.61 31.75,60.96 22.23,60.96 16.51,55.24 16.51,48.9 15.88,48.26 IC1.5
ENCA2
  Top 0.178: U1.1 45.46,33.28 43.81,34.92 41.27,34.92 37.47,38.73 37.47,54.61 31.75,60.33 22.23,60.33 17.14,55.24 IC1.9
ENCB1
  Top 0.178: IC2.5 28.57,43.18 37.47,34.29 43.81,34.29 45.62,32.48 U1.2
ENCB2
  Top 0.178: U1.9 48,24.51 47.76,24.27 40.45,24.27 39.83,24.89 39.83,31.29 27.94,43.18 27.94,48.9 29.84,50.8 IC2.9
ENCC1
  Top 0.178: IC3.5 15.88,28.57 16.51,29.21 16.51,32.38 22.06,37.94 29.53,37.94 32.07,35.4 35.09,35.4 39.37,31.11 39.37,24.77 40.32,23.81 47.94,23.81 48.8,24.67 U1.10
ENCC2  (1 unrouted)
  Top 0.178: U1.11 49.6,24.84 48.1,23.34 40.16,23.34 38.73,24.77 38.73,31.11 34.92,34.92 31.75,34.92 29.21,37.47 22.23,37.47 17.14,32.38 17.14,31.11
ENCD1
  Top 0.178: IC4.5 28.57,28.57 29.21,29.21 29.21,32.38 31.11,34.29 34.92,34.29 38.1,31.11 38.1,24.77 40,22.87 48.27,22.87 50.4,25 U1.12
ENCD2
  Top 0.178: U1.13 51.2,25.16 48.42,22.38 39.85,22.38 37.47,24.77 37.47,31.11 34.92,33.66 31.11,33.66 29.84,32.38 IC4.9
FTDI_RST  (via drill 0.3 pad 0.5)
  Top 0.178: JP1.P$1 v59.05,24.77 | v46.99,35.56 44.41,35.56 44.18,35.78 42.32,35.78 41.91,36.2 41.91,38.95 42.32,39.36 43.55,39.36 C_RST.2
  Bottom 0.178: v59.05,24.77 59.05,27.3 57.78,28.57 56.52,28.57 53.98,31.11 53.98,33.02 52.07,34.92 47.62,34.92 v46.99,35.56
GND  (via drill 0.3 pad 0.5)
  other vias: 22.82,73.03 23.78,73.03 24.74,73.03 24.74,73.83 23.78,73.83 22.82,73.83 34.92,74.3 38.73,74.3 34.92,66.67 38.73,66.67 34.92,60.96 40.64,60.33 38.1,57.78 41.27,54.61 45.09,55.88 44.77,53.02 41.27,52.7 41.27,50.16 44.77,49.85 41.27,46.35 40.01,43.81 41.27,41.27 44.81,44.82 39.37,50.16 39.37,52.7 36.2,52.7 36.2,50.16 31.14,46.51 33.6,48.54 21,48.54 18.51,46.52 8.29,48.38 33.65,26.91 32.31,50.16 32.31,52.65 19.7,52.65 19.7,50.16 23.75,50.16 10.84,50.16 10.84,28.54 23.44,28.7 19.39,28.7 19.55,31.18 32.15,31.18 32.15,28.54 26.04,59.05 26.04,61.91 33.66,56.83 20.32,56.83 13.65,40.01 13.34,37.47 20.64,40.32 20,37.47 24.77,38.73 26.04,36.51 33.66,36.2 32.7,40.64 36.51,43.81 39.69,35.24 39.37,33.34 35.24,31.75 36.2,28.26 44.77,31.75 44.77,30.8 40.96,26.67 37.78,22.86 31.11,24.77 18.41,24.77 43.18,19.68 48.26,19.68 40.96,17.46 44.45,13.97 44.45,10.16 47.62,10.16 47.62,13.65 46.04,16.51 49.53,16.83 50.48,13.34 50.48,10.16 47.62,4.13 43.81,5.08 51.12,5.08 10.79,18.1 10.79,14.92 13.65,13.65 13.65,17.78 15.88,11.11 13.02,7.62 10.16,10.48 5.4,15.56 6.35,19.37 2.22,22.86 2.22,30.8 6.03,26.67 6.03,34.29 8.89,37.78 2.86,37.78 7.94,40.96 9.53,44.45 14.61,44.45 42.23,62.87 42.23,66.36 47.62,57.15 49.85,53.02 51.12,48.58 22.54,9.21 23.18,13.02 23.18,17.46 21.91,23.18 27.62,22.54 26.04,13.02 26.04,9.21 30.48,18.41 32.07,15.56 37.47,17.46 48.9,30.8 48.9,28.57 58.42,31.43 56.83,31.43 53.02,37.78 56.2,38.1 56.2,34.61 1.59,42.23 1.59,46.67 1.59,50.48 1.59,54.29 1.59,58.1 1.59,61.91 1.59,65.72 1.59,69.53 1.59,73.34 1.59,77.15 1.59,80.96 1.59,84.14 6.03,85.41 9.21,85.41 13.02,84.77 16.19,84.77 19.37,84.77 21.91,84.77 47.31,87.63 45.09,89.53 42.55,87.63 45.09,85.72 42.23,81.92 52.39,80.01 52.7,72.71 52.7,69.85 52.7,66.36 52.7,63.82 52.7,60.64 52.7,57.47 52.7,53.02 52.7,49.85 41.27,12.06 36.83,12.06 56.52,46.67 58.42,48.26 56.52,44.77 58.42,44.77 60.64,48.26 56.2,42.55 56.2,40.64 58.74,41.27 55.88,21.27 56.83,23.18 49.85,49.85 46.67,49.85 46.04,53.02 38.1,6.67 40.64,6.67 40.64,90.81 36.83,91.76 36.83,87.63 38.73,87.63 40.01,94.93 42.86,94.61 45.09,94.61 50.16,95.25 49.21,90.81 45.09,92.08 42.86,92.08 35.88,83.19 39.05,83.19
  pour Top (rank 6): 0,120.02 75.56,120.02 75.56,0 0,0
  pour Top (no thermals): 20.95,74.93 20.95,71.75 26.04,71.75 26.04,74.93
  pour Bottom (rank 6): -6.99,103.5 -6.99,-6.99 69.85,-6.99 69.85,103.5
ISP_5V  (via drill 0.3 pad 0.5)
  Top 0.305: v62.87,19.68 JP5.3
  Bottom 0.305: J1.2 v62.87,19.68
MISO  (via drill 0.3 pad 0.5)
  Top 0.178: J1.1 51.26,19.68 v51.18,19.76 | v51.44,22.86 53.6,25.02 U1.16
  Bottom 0.178: v51.18,19.76 51.18,22.61 v51.44,22.86
MOSI  (via drill 0.3 pad 0.5)
  Top 0.178: U1.15 52.8,25.5 v50.16,22.86 | J1.4 59.69,17.14 58.42,15.88 56.52,15.88 55.88,16.51 55.88,17.78 54.61,19.05 50.8,19.05 v50.16,19.68
  Bottom 0.178: v50.16,22.86 v50.16,19.68
N$2  (via drill 0.8 pad 0.5)
  Top 0.178: 45.88,14.45 45.88,11.38 v45.9,8.4
  Top 0.813: DRIVER1.VOUT+ 41.56,18.76 45.88,14.45 X1.2
N$5
  Top 0.178: X3.1 17.14,5.08 3.17,19.05 3.17,36.83 6.36,40.01 9.53,40.01 10.79,41.27 R_ENC1.2
N$6
  Top 0.178: X3.2 15.88,6.99 3.81,19.05 3.81,36.83 6.51,39.53 11.59,39.53 13.34,41.27 R_ENC2.2
N$7
  Top 0.178: RADR0A.1 52.32,77.94 55.54,77.94 56.32,78.72 56.47,78.72 56.49,78.74 ADR0.3
N$8
  Top 0.178: U1.7 43.79,28.48 Y1.1
N$9
  Top 0.178: ADR0.1 58.29,80.14 57.15,81.28 RADR0B.2
N$10
  Top 0.178: RADR1A.1 52.34,77.01 55.54,77.01 56.35,76.2 ADR1.3
N$11
  Top 0.178: ADR1.1 58.42,76.2 59.05,76.83 59.05,80.01 55.24,83.82 RADR1B.2
N$12
  Top 0.178: 29.96,68.85 U$1.4
  Top 0.406: C2.1 29.96,68.85
N$13
  Top 0.178: C7.1 IC1.11 14.61,50.8 12.06,48.26 IC1.2 IC1.1 R_ENC1.1
N$14  (via drill 0.3 pad 0.5)
  Top 0.178: C8.1 IC1.13 IC1.12 13.34,50.8 v12.7,50.16 | R_ENC2.1 IC1.3 13.34,48.26 v13.97,48.9
  Bottom 0.178: v13.97,48.9 v12.7,50.16
N$15
  Top 0.178: X3.5 20.95,5.71 20.95,7.62 20.32,8.26 19.05,8.26 17.78,9.53 15.24,9.53 11.75,13.02 11.75,18.41 10.79,19.37 R_ENC3.2
N$16
  Top 0.178: Y1.3 44.3,25.47 U1.8
N$17  (via drill 0.3 pad 0.5)
  Top 0.406: VREG.1 37.03,89.83 D1.C | v50.8,93.34 C34.1
  Top 0.813: L1.2 38.1,92.97 | 38.1,92.97 38.1,90.17 37.84,89.91 VREG.1 | 38.1,92.97 38.47,93.34 v40.01,93.34 C33.1
  Bottom 0.406: C21.+ v50.8,93.34
  Bottom 0.813: v40.01,93.34 v50.8,93.34
N$18  (1 unrouted)
  Top 0.178: X3.6 20.32,8.89 19.05,8.89 17.78,10.16 15.24,10.16 12.38,13.02 12.38,18.41 13.34,19.37 13.34,20.32
N$19
  Top 0.178: R8.2 46.75,94.44 5VLED.C
N$20  (via drill 0.3 pad 0.5)
  Top 0.178: R2.1 47.62,38.9 v47.64,38.92 | v60.33,33.66 59.05,33.66 53.98,38.73 v53.98,40.01
  Bottom 0.178: v47.64,38.92 47.62,38.93 47.62,39.37 48.26,40.16 53.82,40.16 v53.98,40.01 | JP1.P$2 63.01,28.72 63.01,32.83 62.23,33.6 60.38,33.6 v60.33,33.66
N$21
  Top 0.178: R_ENC3.1 IC3.1 IC3.2 12.06,26.67 14.61,29.21 IC3.11 C9.1
N$22  (via drill 0.3 pad 0.5)
  Top 0.178: C10.1 IC3.13 IC3.12 13.34,29.21 v12.7,28.57 | R_ENC4.1 IC3.3 13.34,26.67 v13.97,27.3
  Bottom 0.178: v13.97,27.3 v12.7,28.57
N$24  (via drill 0.3 pad 0.5)  (1 unrouted)
  Top 0.178: 49.46,39.14 R1.1 v49.53,38.89 v49.54,38.9 | v53.07,39.37 53.07,39.01 59.05,33.02 59.7,33.02 60.21,32.52 60.21,31.27 61.61,29.87
  Bottom 0.178: v53.07,39.37 50.01,39.37 v49.54,38.9
N$25
  Top 0.305: JP1.P$4 62.23,32.38 63.18,31.43 63.18,23.5 62.87,23.18 JP5.1
N$27
  Top 0.178: R_ENC5.1 IC4.1 IC4.2 24.77,26.67 27.3,29.21 IC4.11 C11.1
N$28  (via drill 0.3 pad 0.5)
  Top 0.178: R_ENC6.1 IC4.3 26.04,26.67 v26.67,27.3 | v25.4,28.57 26.04,29.21 IC4.12 IC4.13 C12.1
  Bottom 0.178: v26.67,27.3 v25.4,28.57
N$29
  Top 0.178: POWERLED.C R4.2
N$32
  Top 0.178: X3.9 28.57,5.71 28.57,10.07 R_BUT1.2
N$33
  Top 0.178: R_BUT2.2 X3.10
N$34
  Top 0.178: X3.11 31.11,5.71 31.11,7.62 33.02,9.53 R_BUT3.2 33.02,10.79
N$37
  Top 0.178: X3.12 29.84,8.26 31.11,9.53 R_BUT4.2
N$43  (1 unrouted)
  Top 0.178: X3.7 23.5,5.71 23.5,7.62 24.45,8.57 24.45,18.1 23.5,19.05 23.5,20.32
N$44
  Top 0.178: R_ENC6.2 26.04,19.05 25.08,18.1 25.08,7.3 X3.8
N$45
  Top 0.178: C13.1 IC2.11 27.3,50.8 24.77,48.26 IC2.2 IC2.1 R_ENC11.1
N$46  (via drill 0.3 pad 0.5)
  Top 0.178: C14.1 IC2.13 IC2.12 26.04,50.8 v25.4,50.16 | R_ENC12.1 IC2.3 26.04,48.26 v26.67,48.9
  Bottom 0.178: v26.67,48.9 v25.4,50.16
N$47  (via drill 0.3 pad 0.5)
  Top 0.178: U$6.8 38.85,69.54 v39.37,69.54 | v40.01,72.39 40.64,73.03 ROUT.1
  Bottom 0.178: v39.37,69.54 40.01,70.17 v40.01,72.39
N$48
  Top 0.178: X3.3 18.41,5.71 18.41,7.62 17.78,8.26 15.24,8.26 4.45,19.05 4.45,36.83 6.67,39.05 21.27,39.05 23.5,41.27 R_ENC11.2
N$49
  Top 0.178: X3.4 17.78,8.89 15.24,8.89 5.08,19.05 5.08,36.83 6.82,38.57 23.18,38.57 26.04,41.27 R_ENC12.2
RST  (via drill 0.3 pad 0.5)
  Top 0.178: v57.15,27.94 58.42,26.67 58.42,23.5 61.59,20.32 61.59,16.51 60.96,15.88 59.05,15.88 J1.5 54.31,14.61 | v50.16,33.02 50.4,33.26 U1.29 50.4,36.09 50.56,36.25 50.56,39.36 50.09,39.83 46.98,39.83 46.67,39.52 46.67,37.78 46.35,37.47 45.81,37.47 R3.2 45.45,37.1 C_RST.1 | S1.4 54.31,14.61 | 54.31,14.61 S1.3
  Bottom 0.178: v57.15,27.94 54.61,27.94 53.5,29.05 53.5,32.86 53.32,33.02 52.43,33.91 51.34,33.91 50.44,33.02 v50.16,33.02
RX
  Top 0.178: U1.30 49.6,37.3 R1.2
SCK
  Top 0.178: J1.3 57.78,17.14 59.05,18.41 59.05,22.23 57.78,23.5 57.78,26.04 56.14,27.68 U1.17
SCL
  Top 0.178: 48.27,46.35 48.27,51.43 48.26,51.44 48.26,55.24 41.27,62.23 41.27,67.31 | EMOVE.1 48.27,46.35 | U$6.3 42.23,71.44 41.27,70.48 41.27,67.31 | JP4.9 58.42,67.31 41.27,67.31 | 48.27,46.35 Q2.2
SCL_5V
  Top 0.178: U1.28 51.2,39.46 Q2.3 46.09,41.45 R7.1
SDA  (via drill 0.3 pad 0.5)  (1 unrouted)
  Top 0.178: U$6.4 42.25,72.09 40.64,70.48 v40.64,68.58 40.64,62.23 47.62,55.24 v47.62,53.98 | v48.9,53.98 48.9,49.43 51.03,47.3 51.77,47.3 52.07,46.99 52.07,46.35 | R6.1 52.16,44.51 Q1.2 | JP4.10 v42.08,68.58
  Bottom 0.178: v47.62,53.98 v48.9,53.98 | v42.08,68.58 v40.64,68.58
SDA_5V
  Top 0.178: U1.27 52,39.47 Q1.3 56.99,41.45 R5.1
TX
  Top 0.178: U1.31 48.8,35.66 47.62,36.83 R2.2
VIN+  (via drill 0.3 pad 0.5, 0.8 pad 0.5)
  Top 0.178: POWERLED.A 13.97,94.61 v12.06,92.71
  Top 0.813: L1.1 v34.92,93.34
  Bottom 0.178: v12.06,92.71 12.06,92.08
  Bottom 0.813: 26.04,90.81 26.04,93.34 27.3,94.61 33.66,94.61 v34.92,93.34
  other vias: 23.5,81.92
  pour Bottom (rank 2): 10.79,96.52 10.79,90.81 23.5,90.81 24.77,89.53 27.63,89.52 27.63,96.52
  pour Top (rank 2): 5.08,80.01 6.35,81.28 20.32,81.28 24.77,85.72 27.3,85.72 27.3,82.87 21.27,76.83 6.35,76.83 5.08,78.11
  pour Top (rank 2): 24.77,92.39 24.77,83.19 27.62,83.19 27.62,92.39
VIN-  (via drill 0.8 pad 0.5)
  other vias: 29.21,81.92
  pour Top: 31.11,92.39 28.25,92.39 28.25,82.55 31.11,82.55
  pour Bottom (rank 3): 10.79,85.72 10.79,92.71 31.11,92.71 31.11,85.72
  pour Top: 31.11,83.82 31.11,79.38 27.33,75.59 22.15,75.59 22.12,77.48 24.77,80.01 28.57,83.82
VOUT  (via drill 0.8 pad 0.5)
  Top 0.178: DRIVER1.ANALOGDIM 40.64,77.56 40.64,76.2 | 40.64,76.2 ROUT.2 | v42.55,76.2 40.64,76.2
VOUT-  (via drill 0.8 pad 0.5)
  Top 0.178: 49.38,8.46 v49.32,8.4
  Top 0.813: X1.1 49.38,8.46 49.38,15.28 DRIVER1.VOUT-

### Text on the board
tNames: HIGH | LOW | 12V | GND | 5V | DIM | 3.3V | V+ | V-
200bmp: /Users/wes/Drive/carimbos2 pcb.BMP